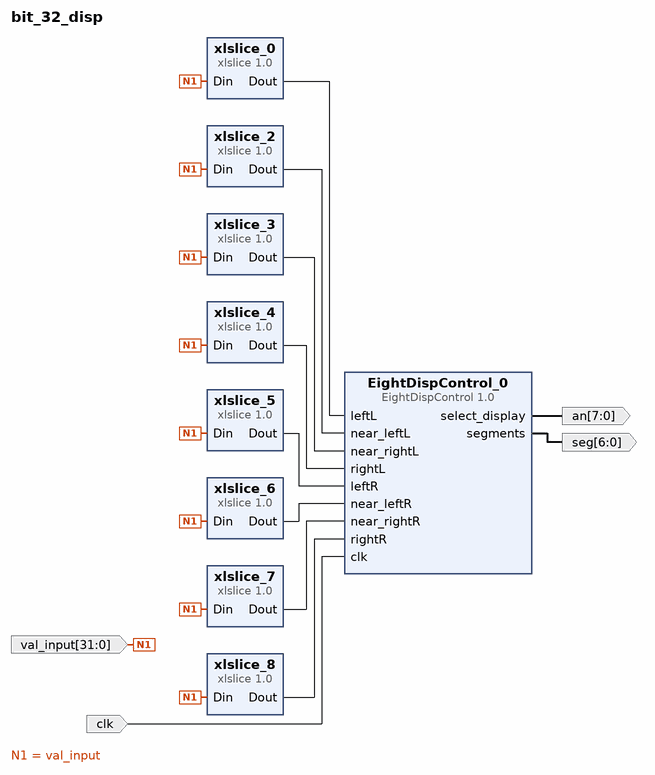
[diagram p0: block diagram of the top level]
# Vivado block design bit_32_disp, xc7a100tcsg324-1, Vivado 2016.4
create_bd_design bit_32_disp

create_bd_port -dir O -from 7 -to 0 an
create_bd_port -dir O -from 6 -to 0 seg
create_bd_port -dir I clk
create_bd_port -dir I -from 31 -to 0 val_input

create_bd_cell -type ip -vlnv ua.pt:user:EightDispControl:1.0 EightDispControl_0
create_bd_cell -type ip -vlnv xilinx.com:ip:xlslice:1.0 xlslice_0
set_property -dict {CONFIG.DOUT_WIDTH 4 CONFIG.DIN_TO 28 CONFIG.DIN_FROM 31} [get_bd_cells xlslice_0]
create_bd_cell -type ip -vlnv xilinx.com:ip:xlslice:1.0 xlslice_2
set_property -dict {CONFIG.DOUT_WIDTH 4 CONFIG.DIN_TO 24 CONFIG.DIN_FROM 27} [get_bd_cells xlslice_2]
create_bd_cell -type ip -vlnv xilinx.com:ip:xlslice:1.0 xlslice_3
set_property -dict {CONFIG.DOUT_WIDTH 4 CONFIG.DIN_TO 20 CONFIG.DIN_FROM 23} [get_bd_cells xlslice_3]
create_bd_cell -type ip -vlnv xilinx.com:ip:xlslice:1.0 xlslice_4
set_property -dict {CONFIG.DOUT_WIDTH 4 CONFIG.DIN_TO 16 CONFIG.DIN_FROM 19} [get_bd_cells xlslice_4]
create_bd_cell -type ip -vlnv xilinx.com:ip:xlslice:1.0 xlslice_5
set_property -dict {CONFIG.DOUT_WIDTH 4 CONFIG.DIN_TO 12 CONFIG.DIN_FROM 15} [get_bd_cells xlslice_5]
create_bd_cell -type ip -vlnv xilinx.com:ip:xlslice:1.0 xlslice_6
set_property -dict {CONFIG.DOUT_WIDTH 4 CONFIG.DIN_TO 8 CONFIG.DIN_FROM 11} [get_bd_cells xlslice_6]
create_bd_cell -type ip -vlnv xilinx.com:ip:xlslice:1.0 xlslice_7
set_property -dict {CONFIG.DOUT_WIDTH 4 CONFIG.DIN_TO 4 CONFIG.DIN_FROM 7} [get_bd_cells xlslice_7]
create_bd_cell -type ip -vlnv xilinx.com:ip:xlslice:1.0 xlslice_8
set_property -dict {CONFIG.DOUT_WIDTH 4 CONFIG.DIN_TO 0 CONFIG.DIN_FROM 3} [get_bd_cells xlslice_8]

# ---- connections ----

connect_bd_net [get_bd_pins xlslice_0/Dout] [get_bd_pins EightDispControl_0/leftL]
connect_bd_net [get_bd_pins xlslice_2/Dout] [get_bd_pins EightDispControl_0/near_leftL]
connect_bd_net [get_bd_pins xlslice_3/Dout] [get_bd_pins EightDispControl_0/near_rightL]
connect_bd_net [get_bd_pins xlslice_4/Dout] [get_bd_pins EightDispControl_0/rightL]
connect_bd_net [get_bd_pins xlslice_5/Dout] [get_bd_pins EightDispControl_0/leftR]
connect_bd_net [get_bd_pins xlslice_6/Dout] [get_bd_pins EightDispControl_0/near_leftR]
connect_bd_net [get_bd_pins xlslice_7/Dout] [get_bd_pins EightDispControl_0/near_rightR]
connect_bd_net [get_bd_pins xlslice_8/Dout] [get_bd_pins EightDispControl_0/rightR]
connect_bd_net [get_bd_pins EightDispControl_0/segments] [get_bd_ports seg]
connect_bd_net [get_bd_pins EightDispControl_0/select_display] [get_bd_ports an]
connect_bd_net [get_bd_ports clk] [get_bd_pins EightDispControl_0/clk]
connect_bd_net [get_bd_ports val_input] \
  [get_bd_pins xlslice_0/Din] [get_bd_pins xlslice_2/Din] [get_bd_pins xlslice_3/Din] [get_bd_pins xlslice_4/Din] \
  [get_bd_pins xlslice_5/Din] [get_bd_pins xlslice_6/Din] [get_bd_pins xlslice_7/Din] [get_bd_pins xlslice_8/Din]

validate_bd_design
save_bd_design
